# Altium schematic sheet Sheet1.SchDoc
size A3; SheetNumber: 1; SheetTotal: 1
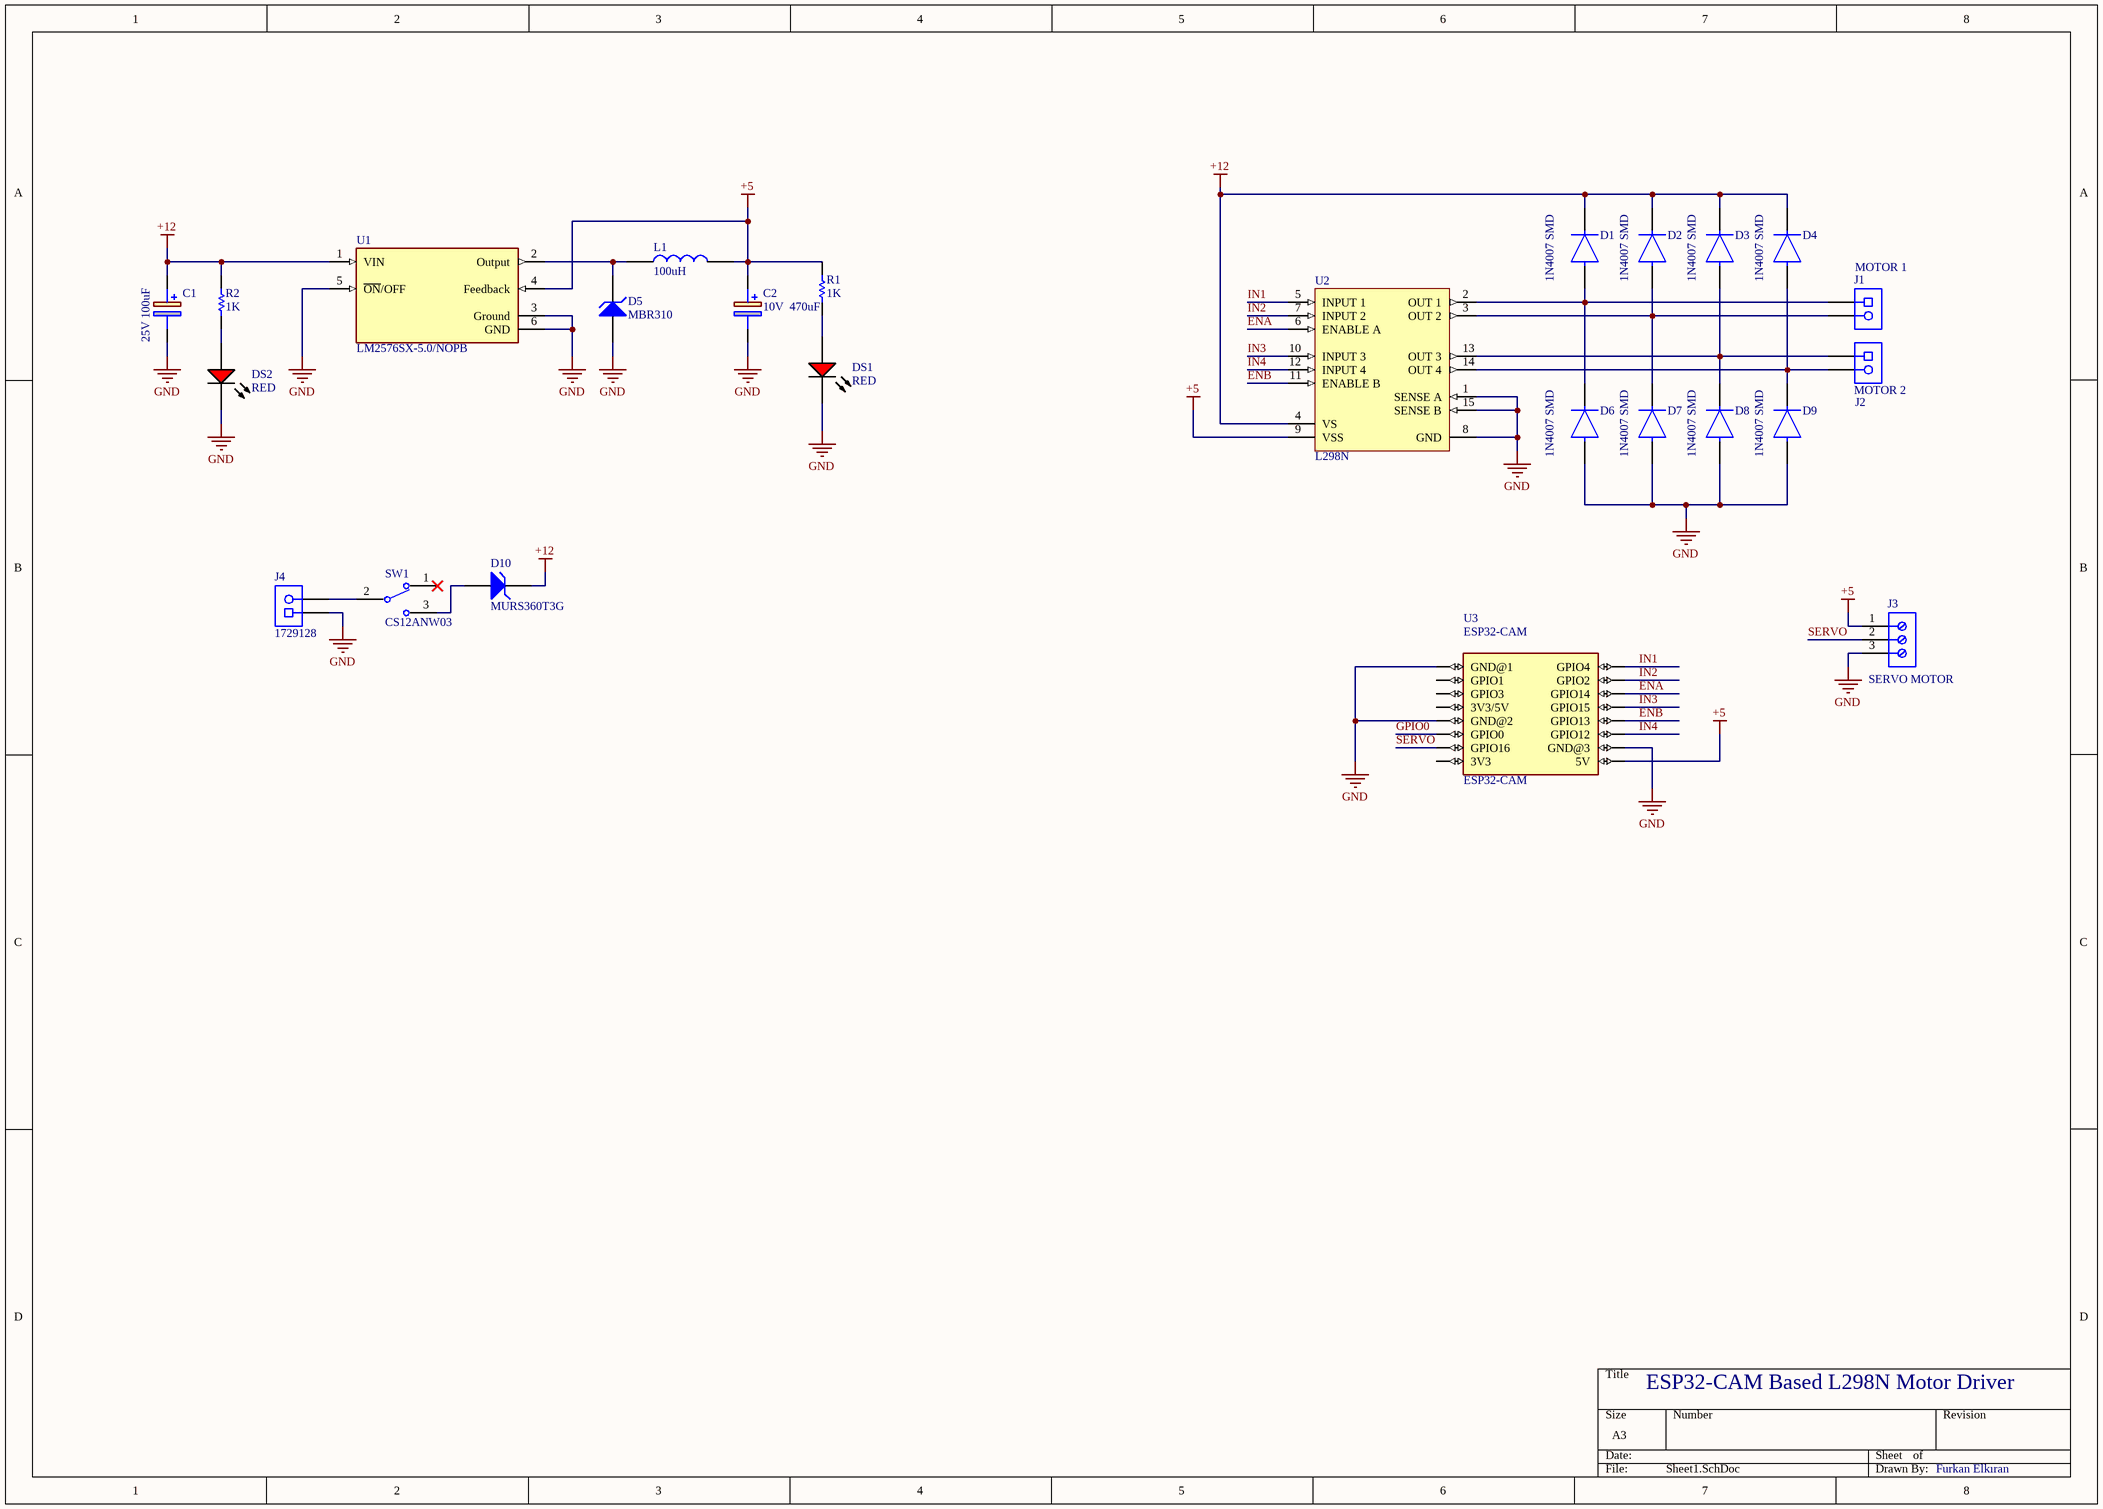
[diagram p0: Sheet1.SchDoc]

## Parts
C1  25V 100uF  [EEHZA1E101XP]
C2  10V  470uF  [EEHZA1E101XP]
D1  1N4007 SMD  [FP-1N4007_SMD-IPC_C]
D2  1N4007 SMD  [FP-1N4007_SMD-IPC_C]
D3  1N4007 SMD  [FP-1N4007_SMD-IPC_C]
D4  1N4007 SMD  [FP-1N4007_SMD-IPC_C]
D5  MBR310  [LFUS-DO-214AB-2_V]
D6  1N4007 SMD  [FP-1N4007_SMD-IPC_C]
D7  1N4007 SMD  [FP-1N4007_SMD-IPC_C]
D8  1N4007 SMD  [FP-1N4007_SMD-IPC_C]
D9  1N4007 SMD  [FP-1N4007_SMD-IPC_C]
D10  MURS360T3G  [LFUS-DO-214AB-2_V]
DS1  RED  [LUMX-SML-LX1206IC_V]
DS2  RED  [LUMX-SML-LX1206IC_V]
J1  MOTOR 1  [PHOE-1729128-2_V]
J2  MOTOR 2  [PHOE-1729128-2_V]
J3  SERVO MOTOR  [691214110003]
J4  1729128  [PHOE-1729128-2_V]
L1  100uH  [SRR1260101M]
R1  1K  [RESC3216X70X50NL05T20]
R2  1K  [RESC3216X70X50NL05T20]
SW1  CS12ANW03  [FP-CS12ANW03-MFG]
U1  LM2576SX-5.0/NOPB  [FP-KTT0005B-MFG]
U2  L298N  [STM-FM-15]
U3  ESP32-CAM  [ESP32-CAM]

## Nets
+5: C2.1(+) J3.1 L1.2 R1.2 U1.4(Feedback) U2.9(VSS) U3.P$9(5V)
+12: C1.1(+) D1.1(C) D2.1(C) D3.1(C) D4.1(C) D10.2(K) R2.2 U1.1(VIN) U2.4(VS)
GND: C1.2(-) C2.2(-) D5.1(A) D6.2(A) D7.2(A) D8.2(A) D9.2(A) DS1.2(K) DS2.2(K) J3.3 J4.1 U1.3(Ground) U1.5(~{ON}/OFF) U1.6(GND) U2.1(SENSE_A) U2.8(GND) U2.15(SENSE_B) U3.P$1(GND@1) U3.P$5(GND@2) U3.P$10(GND@3)
ENA: U2.6(ENABLE_A) U3.P$14(GPIO14)
ENB: U2.11(ENABLE_B) U3.P$12(GPIO13)
GPIO0: U3.P$6(GPIO0)
IN1: U2.5(INPUT_1) U3.P$16(GPIO4)
IN2: U2.7(INPUT_2) U3.P$15(GPIO2)
IN3: U2.10(INPUT_3) U3.P$13(GPIO15)
IN4: U2.12(INPUT_4) U3.P$11(GPIO12)
SERVO: J3.2 U3.P$7(GPIO16)
NetD1_2: D1.2(A) D6.1(C) J1.1 U2.2(OUT_1)
NetD2_2: D2.2(A) D7.1(C) J1.2 U2.3(OUT_2)
NetD3_2: D3.2(A) D8.1(C) J2.1 U2.13(OUT_3)
NetD4_2: D4.2(A) D9.1(C) J2.2 U2.14(OUT_4)
NetD5_2: D5.2(K) L1.1 U1.2(Output)
NetD10_1: D10.1(A) SW1.3
NetDS1_1: DS1.1(A) R1.1
NetDS2_1: DS2.1(A) R2.1
NetJ4_2: J4.2 SW1.2(2(COM))

Not connected (* = marked no-connect by the designer): SW1 1*; U3 P$2(GPIO1) P$3(GPIO3) P$4(3V3/5V) P$8(3V3)

## Notes on the sheet
- ESP32-CAM Based L298N Motor Driver
- Furkan Elkıran

## Library data of the parts
C1 = EEH-ZA1E101XP: BXJ25VC100MF80TP; Manufacturer_Name: Panasonic; Geometry.Height: 8.3mm; Manufacturer_Part_Number: EEH-ZA1E101XP; Mouser Part Number: 667-EEH-ZA1E101XP; Mouser Price/Stock: https://www.mouser.co.uk/ProductDetail/Panasonic/EEH-ZA1E101XP?qs=7UCyOFMWVHbBL6OBgRrCPQ%3D%3D; Arrow Part Number: *; Arrow Price/Stock: *; Datasheet Link: http://industrial.panasonic.com/cdbs/www-data/pdf/RDD0000/ABA0000C1221.pdf
C2 = EEH-ZA1E101XP: EEE-FTA471XAP; Manufacturer_Name: Panasonic; Geometry.Height: 8.3mm; Manufacturer_Part_Number: EEH-ZA1E101XP; Mouser Part Number: 667-EEH-ZA1E101XP; Mouser Price/Stock: https://www.mouser.co.uk/ProductDetail/Panasonic/EEH-ZA1E101XP?qs=7UCyOFMWVHbBL6OBgRrCPQ%3D%3D; Arrow Part Number: *; Arrow Price/Stock: *; Datasheet Link: http://industrial.panasonic.com/cdbs/www-data/pdf/RDD0000/ABA0000C1221.pdf
D1-D4 D6-D9 = CMP-12389-000001-1: Rectifier, 1Kv, 1A, Do-214Ac Rohs Compliant: Yes
D5 = CMP-2000-07111-1: MB310_R1_00001; Manufacturer: Littelfuse; Type: Zener; Featured Product: LittelfuseandDigi-KeyofferkitsforpopularTVSSMDdiodes; Power - Peak Pulse: 1500W(1.5kW); Current - Peak Pulse (10/1000µs): 145.7A; Power Line Protection: No; Voltage - Clamping (Max) @ Ipp: 10.3V; Unidirectional Channels: 1; Voltage - Reverse Standoff (Typ): 6V; Catalog Drawings: SMCJDO-214ABSeries; Voltage - Breakdown (Min): 6.67V; Bidirectional Channels: -; Series: SMCJ; Mounting Technology: SurfaceMount; Supplier Device Package: DO-214AB(SMCJ); Packaging: Tape&Reel(TR); Family: TVS-Diodes; Applications: GeneralPurpose; Package Description: 2-Pin Surface Mount Device, Body 6.855 x 5.905 mm; Datasheet Version: 11/2015; Operating Temperature: -55°C~150°C(TJ); Package Reference: DO-214AB; Capacitance @ Frequency: -; Datasheet URL: http://www.littelfuse.com/products/tvs-diodes/surface-mount/~/media/electronics/datasheets/tvs_diodes/littelfuse_tvs_diode_smcj_datasheet.pdf.pdf; Category: CircuitProtection; Package / Case: DO-214AB,SMC; Mounting Type: SurfaceMount; Manufacturer URL: http://www.littelfuse.com/; Standard Package: 3,000
D10 = CMP-2000-07111-1: Manufacturer: Littelfuse; Type: Zener; Featured Product: LittelfuseandDigi-KeyofferkitsforpopularTVSSMDdiodes; Power - Peak Pulse: 1500W(1.5kW); Current - Peak Pulse (10/1000µs): 145.7A; Power Line Protection: No; Voltage - Clamping (Max) @ Ipp: 10.3V; Unidirectional Channels: 1; Voltage - Reverse Standoff (Typ): 6V; Catalog Drawings: SMCJDO-214ABSeries; Voltage - Breakdown (Min): 6.67V; Bidirectional Channels: -; Series: SMCJ; Mounting Technology: SurfaceMount; Supplier Device Package: DO-214AB(SMCJ); Packaging: Tape&Reel(TR); Family: TVS-Diodes; Applications: GeneralPurpose; Package Description: 2-Pin Surface Mount Device, Body 6.855 x 5.905 mm; Datasheet Version: 11/2015; Operating Temperature: -55°C~150°C(TJ); Package Reference: DO-214AB; Capacitance @ Frequency: -; Datasheet URL: http://www.littelfuse.com/products/tvs-diodes/surface-mount/~/media/electronics/datasheets/tvs_diodes/littelfuse_tvs_diode_smcj_datasheet.pdf.pdf; Category: CircuitProtection; Package / Case: DO-214AB,SMC; Mounting Type: SurfaceMount; Manufacturer URL: http://www.littelfuse.com/; Standard Package: 3,000
DS1 DS2 = CMP-2000-07123-1: HL-PC-3216S9AC; Manufacturer: Lumex; Part No: SML-LX1206IC-TR; LED Material: GaAsP; Peak Wavelength: 635nm; Number of LEDs: 1; Viewing Angle: 160; Reverse Voltage: 5(Min)V; Lens Appearance: ColorlessNonDiffused; Intensity: 6mcd; Type: Uni-Color; Pin_Count: 2; Lens Dimensions: 2x1.6x0.5mm; Mounting: SurfaceMount; ECCN: EAR99; RoHS: Unknown; Package Description: 2-Pin Surface Mount Device, Body 3.2 x 1.5 mm; Mounting Technology: SurfaceMount; Dominant Wavelength: N/A; Supplier_Package: SMD; Supplier Standard Pack: 3,000; Color: Red; Dimension: 3.2x1.6x1.1mm; HTS: 8541402000; Family: SML-LX1206IC; Supplier: Lumex; Datasheet URL: http://www.lumex.com/content/files/ProductAttachment/SML-LX1206IC-TR.pdf; Package Reference: SML-LX1206IC; Manufacturer URL: http://www.lumexinstruments.com/; Operating Temperature: -25to85C; Packaging: TapeandReel; Datasheet Version: Rev. J, 08/2012
J1 J2 = CMP-2000-05815-1: PCB Terminal Block, 13.5 A, 400 V, 2-Pin THD, RoHS, Bulk; PartNumber: 1729128; Manufacturer: Phoenix Contact; Package Version: 03/2015; No. of Rows: 1; Pitch: 5.08mm; No. of Positions: 2; Voltage Rating: 400V; Current Rating: 13500mA; Manufacturer URL: http://www.phoenixcontact.com/; Datasheet URL: https://datasheet.ciiva.com/16046/1729128-16046181.pdf; RoHS: TRUE; Package URL: https://www.phoenixcontact.com/online/portal/pi/pxc/product_detail_page/!ut/p/b1/3VdJjqNKFDxLH8AFycySyWY2ozFsEPOMMQaDOX1XedGL_1Vdm5YXJleknhSKeBkvI6EA8ncAo3AYoDhBQGco6KN7VURTdemj9us_IEKEZo_YHiPAEWEFmDGOHMORkqKYCORBZxgL7ZoaZYcbFFUZ3fqxSY6GOuxydWUuHqz1ynmMFygu583Bob0Ewr6Sd_l-5m-kAueHiB0jpRwZwe58wwtkpxtMYd_LmGcDRU02dRNEyWt6Y2ti5pSyJ_reIkzIulrqApdnbT11V5jnCKbYNCvhEM1MCpPByat_X379-iThf08CI5GfOPqfBeS3BRoBOdD55AKVv0iLwCMq-2BrzXWSGRH7pUGD9uwXQjiph3xL0DKQwdGa0JImiIOmBNOestqgwTHSSs2oOep-78apyXQBvNi8ZLaFjvjWvcaUEBu0MC6Wbe-d6mB0FAebo2lUWinqYaZs5DAYzV0RP9yitUjnGJ0iI9xhZkT42OCQNUJJhkgWINNQLP2JFP6OpMg3JCVg70jqHT0lvKOnhHf0lPuOnnLf0VPuWx6_dxwUIvwk5WMkT0kLL1mh61l2yZVSzG3pYV_bqo-mj6uMKwKwdnnW8Jh5RTOJzMOA5c-eJDaZQw4mTMPH02PvS_ZAqNVjVTo2WyYLkwH_KU1mmmG5kjRhDqPXLwwVHvVOjCM60-fpXvTDfMGW1PVFVS1r4e4yVDk4ZdNbkUHvqPqQSeian4UD39fNKmachqdJ1NJbyk8rXT9mXTvPk3oE5meulKGgiruPJek-4I9hTT6G8ZLOyRSm2RRVbThERQad5OS28hdt4YW4vG0stgYYzsWsK4_7y6DZMjJSCqri1kyiZR5vD7pwIrNR7QwPHTcLTI5qT7eRlpHrdGiupYlqQDJ7zy_CND8fWWBoLRXxk1RVcXiBQwbTD4Xi7KL-FuO94t9xaqweXzH; Package Description: 2-Pin Through Hole Device, Body 8.1 x 10.16 mm, Pitch 5.08 mm; Datasheet Version: 12/2013; Mounting Technology: ThroughHole; Orientation: Horizontal; Package Reference: 1729128-2; Packing: Bulk
J3 = CMP-1502-02466-2: NexarPartId: 18818289; Number of Levels: 1; Voltage: 300V; Pitch: 3.5052mm; Stripping Length: -6mm; Number of Positions Per Level: 3; Plating: Brass, Steel; Wire/Cable Gauge: 24AWG; Wire Gauge (Min): 16AWG; Current Rating: 10A; Width: 10.9mm; Length: 7.4mm; Housing Material: Nylon; Height: 12.2mm; Min Operating Temperature: -40°C; Contact Plating: Brass, Tin; Packaging: Box; Color: Blue, Green; Number of Contacts: 3; Number of Pins: 3; Voltage Rating: 300V; Termination: Screw; Lead Pitch: 3.5mm; Max Operating Temperature: 105°C; Mount: Through Hole; Contact Material: Brass; RoHS: Compliant; Wire Gauge (Max): 24AWG; Current: 10A; REACH SVHC: Unknown
J4 = CMP-2000-05815-1: PCB Terminal Block, 13.5 A, 400 V, 2-Pin THD, RoHS, Bulk; Manufacturer: Phoenix Contact; Package Version: 03/2015; No. of Rows: 1; Pitch: 5.08mm; No. of Positions: 2; Voltage Rating: 400V; Current Rating: 13500mA; Manufacturer URL: http://www.phoenixcontact.com/; Datasheet URL: https://datasheet.ciiva.com/16046/1729128-16046181.pdf; RoHS: TRUE; Package URL: https://www.phoenixcontact.com/online/portal/pi/pxc/product_detail_page/!ut/p/b1/3VdJjqNKFDxLH8AFycySyWY2ozFsEPOMMQaDOX1XedGL_1Vdm5YXJleknhSKeBkvI6EA8ncAo3AYoDhBQGco6KN7VURTdemj9us_IEKEZo_YHiPAEWEFmDGOHMORkqKYCORBZxgL7ZoaZYcbFFUZ3fqxSY6GOuxydWUuHqz1ynmMFygu583Bob0Ewr6Sd_l-5m-kAueHiB0jpRwZwe58wwtkpxtMYd_LmGcDRU02dRNEyWt6Y2ti5pSyJ_reIkzIulrqApdnbT11V5jnCKbYNCvhEM1MCpPByat_X379-iThf08CI5GfOPqfBeS3BRoBOdD55AKVv0iLwCMq-2BrzXWSGRH7pUGD9uwXQjiph3xL0DKQwdGa0JImiIOmBNOestqgwTHSSs2oOep-78apyXQBvNi8ZLaFjvjWvcaUEBu0MC6Wbe-d6mB0FAebo2lUWinqYaZs5DAYzV0RP9yitUjnGJ0iI9xhZkT42OCQNUJJhkgWINNQLP2JFP6OpMg3JCVg70jqHT0lvKOnhHf0lPuOnnLf0VPuWx6_dxwUIvwk5WMkT0kLL1mh61l2yZVSzG3pYV_bqo-mj6uMKwKwdnnW8Jh5RTOJzMOA5c-eJDaZQw4mTMPH02PvS_ZAqNVjVTo2WyYLkwH_KU1mmmG5kjRhDqPXLwwVHvVOjCM60-fpXvTDfMGW1PVFVS1r4e4yVDk4ZdNbkUHvqPqQSeian4UD39fNKmachqdJ1NJbyk8rXT9mXTvPk3oE5meulKGgiruPJek-4I9hTT6G8ZLOyRSm2RRVbThERQad5OS28hdt4YW4vG0stgYYzsWsK4_7y6DZMjJSCqri1kyiZR5vD7pwIrNR7QwPHTcLTI5qT7eRlpHrdGiupYlqQDJ7zy_CND8fWWBoLRXxk1RVcXiBQwbTD4Xi7KL-FuO94t9xaqweXzH; PartNumber: 1729128; Package Description: 2-Pin Through Hole Device, Body 8.1 x 10.16 mm, Pitch 5.08 mm; Datasheet Version: 12/2013; Mounting Technology: ThroughHole; Orientation: Horizontal; Package Reference: 1729128-2; Packing: Bulk
L1 = SRR1260-101M: SRI1209-101M; Manufacturer_Name: Bourns; Geometry.Height: 6.5mm; Manufacturer_Part_Number: SRR1260-101M; Mouser Part Number: 652-SRR1260-101M; Mouser Price/Stock: https://www.mouser.co.uk/ProductDetail/Bourns/SRR1260-101M?qs=uD%2FoUDWqfvQozr%2Ff4%252BPuSQ%3D%3D; Arrow Part Number: SRR1260-101M; Arrow Price/Stock: https://www.arrow.com/en/products/srr1260-101m/bourns?utm_currency=USD&region=nac; Datasheet Link: https://componentsearchengine.com/Datasheets/1/SRR1260-101M.pdf
R1 R2 = CMP-2003-00541-1: 1206S4F1001T5E; Manufacturer: Panasonic; Part Number: ERJ-8GEY0R00V
SW1 = CMP-31746-000002-1: SWITCH SLIDE SPDT 3A 125V; Max Voltage Rating (AC): 250V; Mechanical Life: 50000Cycles; Switch Travel: 2.2mm; Electrical Life: 20000Cycles; Actuator Length: 5.1mm; Illumination Type: Non-Illuminated; Contact Style: Non-Shorting; Actuator Type: Standard; Actuator Material: Nylon; Switch Function: On-On; Max Operating Temperature: 85°C; Series: CS; Contact Current Rating: 3A; Min Operating Temperature: -30°C; Current Rating: 3A; Mount: Through Hole; Depth: 7.5mm; RoHS Compliant: Yes; Throw Configuration: SPDT; Lead Free: Lead Free; Orientation: Vertical; Contact Plating: Silver; Reach SVHC Compliant: Yes; Termination: PC Pin; Max Current Rating: 3A; Packaging: Tray; Length: 14mm; Package Quantity: 1; Primary Type: SWITCH; Flammability Rating: UL94 V-0; Contact Material: Copper; Voltage Rating (AC): 125V
U1 = CMP-0069-00122-4: IC REG BUCK 5V 3A TO263-5; Efficiency: 77%; Min Input Voltage: 4V; Quiescent Current: 5mA; Synchronous Rectifier: No; Operating Supply Voltage: 40V; Number of Outputs: 1; Switching Frequency: 52kHz; Output Type: Fixed; Max Operating Temperature: 125°C; Radiation Hardening: No; REACH SVHC: No SVHC; Package Quantity: 500; Max Output Current: 3A; Case/Package: TO-263-6; Lead Free: Contains Lead; Contact Plating: Tin; Series: SIMPLE SWITCHER®; Nominal Output Voltage: 5V; Packaging: Tape and Reel; Number of Pins: 5; Max Input Voltage: 40V; Output Voltage: 5V; Min Operating Temperature: -40°C; Output Current: 3A; Mount: Surface Mount
U2 = CMP-2000-06526-1: Dual Full-Bridge Driver, 4.8 to 46 V, -40 to 150 degC, 15-Pin FM (MW 15L), RoHS, Tube; Manufacturer: STMicroelectronics; PartNumber: L298; Output Current: 2A; Supply Voltage Max: 7V; Driver Case Style: Multiwatt; Supply Voltage Min: 4.5V; No. of Pins: 15Pins; SVHC: NoSVHC(17-Dec-2015); Output Voltage: 46V; No. of Outputs: 4Outputs; Motor Type: FullBridge; MSL: -; Package Description: 15-Pin Flange Mount, Body 5 x 19.6 mm, Pitch 1.27 mm; Datasheet Version: 01/2000; Package Reference: FM-15; Mounting Technology: ThroughHole; Packaging: Each; Automotive Qualification Standard: -; Product Range: -; Datasheet URL: https://datasheet.ciiva.com/15109/getdatasheetpartid-50682-15109332.pdf; Operating Temperature Max: 130°C; Operating Temperature Min: -25°C; Manufacturer URL: http://www.st.com/